# EAGLE schematic LED-Driver (EAGLE 7.3.0)
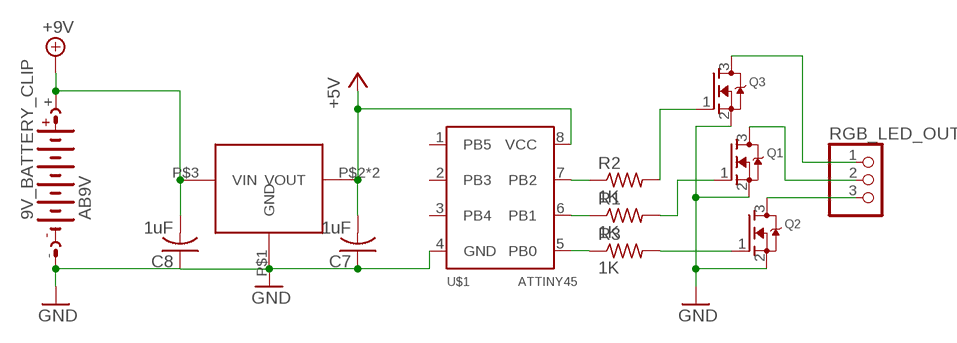
[diagram p0: schematic, sheet 1]

## Parts
5V_LDO  5V_LDO  [SOT-223]
9V_BATTERY_CLIP  AB9V  [AB9V]
C7  1uF  C-USC0805  [C0805]
C8  1uF  C-USC0805  [C0805]
Q1  MOSFET-NREFLOW  [SOT23]
Q2  MOSFET-NREFLOW  [SOT23]
Q3  MOSFET-NREFLOW  [SOT23]
R1  1K  R-US_R0805  [R0805]
R2  1K  R-US_R0805  [R0805]
R3  1K  R-US_R0805  [R0805]
RGB_LED_OUT  PINHD-1X3  [1X03]
U$1  ATTINY45  [SOIC8]

## Nets
+5V: 5V_LDO.P$2(VOUT) 5V_LDO.P$4(VOUT) C7.2 U$1.8(VCC)
+9V: 5V_LDO.P$3(VIN) 9V_BATTERY_CLIP.+ C8.2
GND: 5V_LDO.P$1(GND) 9V_BATTERY_CLIP.- C7.1 C8.1 Q1.2(S) Q2.2(S) Q3.2(S) U$1.4(GND)
N$1: Q1.3(D) RGB_LED_OUT.2
N$2: Q3.3(D) RGB_LED_OUT.1
N$4: Q2.3(D) RGB_LED_OUT.3
N$5: Q2.1(G) R3.2
N$6: R3.1 U$1.5(PB0)
N$7: R1.1 U$1.6(PB1)
N$8: R2.1 U$1.7(PB2)
N$9: Q1.1(G) R1.2
N$10: Q3.1(G) R2.2
Unconnected: U$1.1(PB5) U$1.2(PB3) U$1.3(PB4)

## Library data of the parts
5V_LDO = 5V_LDO_AZ1117E:5V_LDO: 5V LDO Specifically AZ1117E - 5V 1A LDO with 16V max input voltage
9V_BATTERY_CLIP = battery:AB9V: 9-V BATTERY CLIP
C7 C8 = adafruit:C-US: CAPACITOR, American symbol
Q1-Q3 = adafruit:MOSFET-N: N-Channel Mosfet 2N7002E - 60V 260mA SOT23 [Digikey: 2N7002ET1GOSTR-ND] - REEL BSH103 - 30V 850mA SOT23 [Digikey: 568-5013-1-ND]
R1-R3 = adafruit:R-US_: RESISTOR, American symbol
RGB_LED_OUT = pinhead:PINHD-1X3: PIN HEADER
U$1 = attiny45:ATTINY45